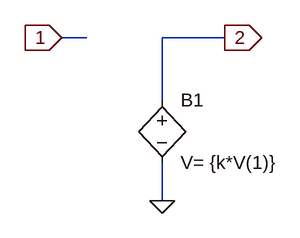
[diagram p0: schematic Gain.asc]
Gain.asc, the LTspice schematic file:
Version 4
SHEET 1 880 680
WIRE 96 48 64 48
WIRE 272 48 192 48
WIRE 192 128 192 48
WIRE 192 256 192 208
FLAG 64 48 1
IOPIN 64 48 In
FLAG 272 48 2
IOPIN 272 48 Out
FLAG 192 256 0
SYMBOL bv 192 112 R0
SYMATTR InstName B1
SYMATTR Value V= {k*V(1)}

The netlist it stands for:
* Gain.asc
B1 2 0 V= {k*V(1)}
.backanno
.end